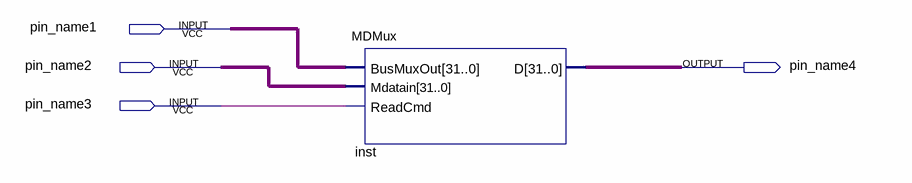
[diagram p0: schematic sheet]
// Quartus schematic SimpleComputer.bdf as structural Verilog: 1 symbols, 4 pins
module SimpleComputer (
  input  pin_name1,
  input  pin_name2,
  input  pin_name3,
  output pin_name4
);

  wire [31:0] inst_d, undriven, undriven_2;

  MDMux inst (.BusMuxOut(undriven), .Mdatain(undriven_2), .ReadCmd(pin_name3), .D(inst_d));
endmodule
